# EAGLE board baseboard (EAGLE 9.6.2), part 1 of 2
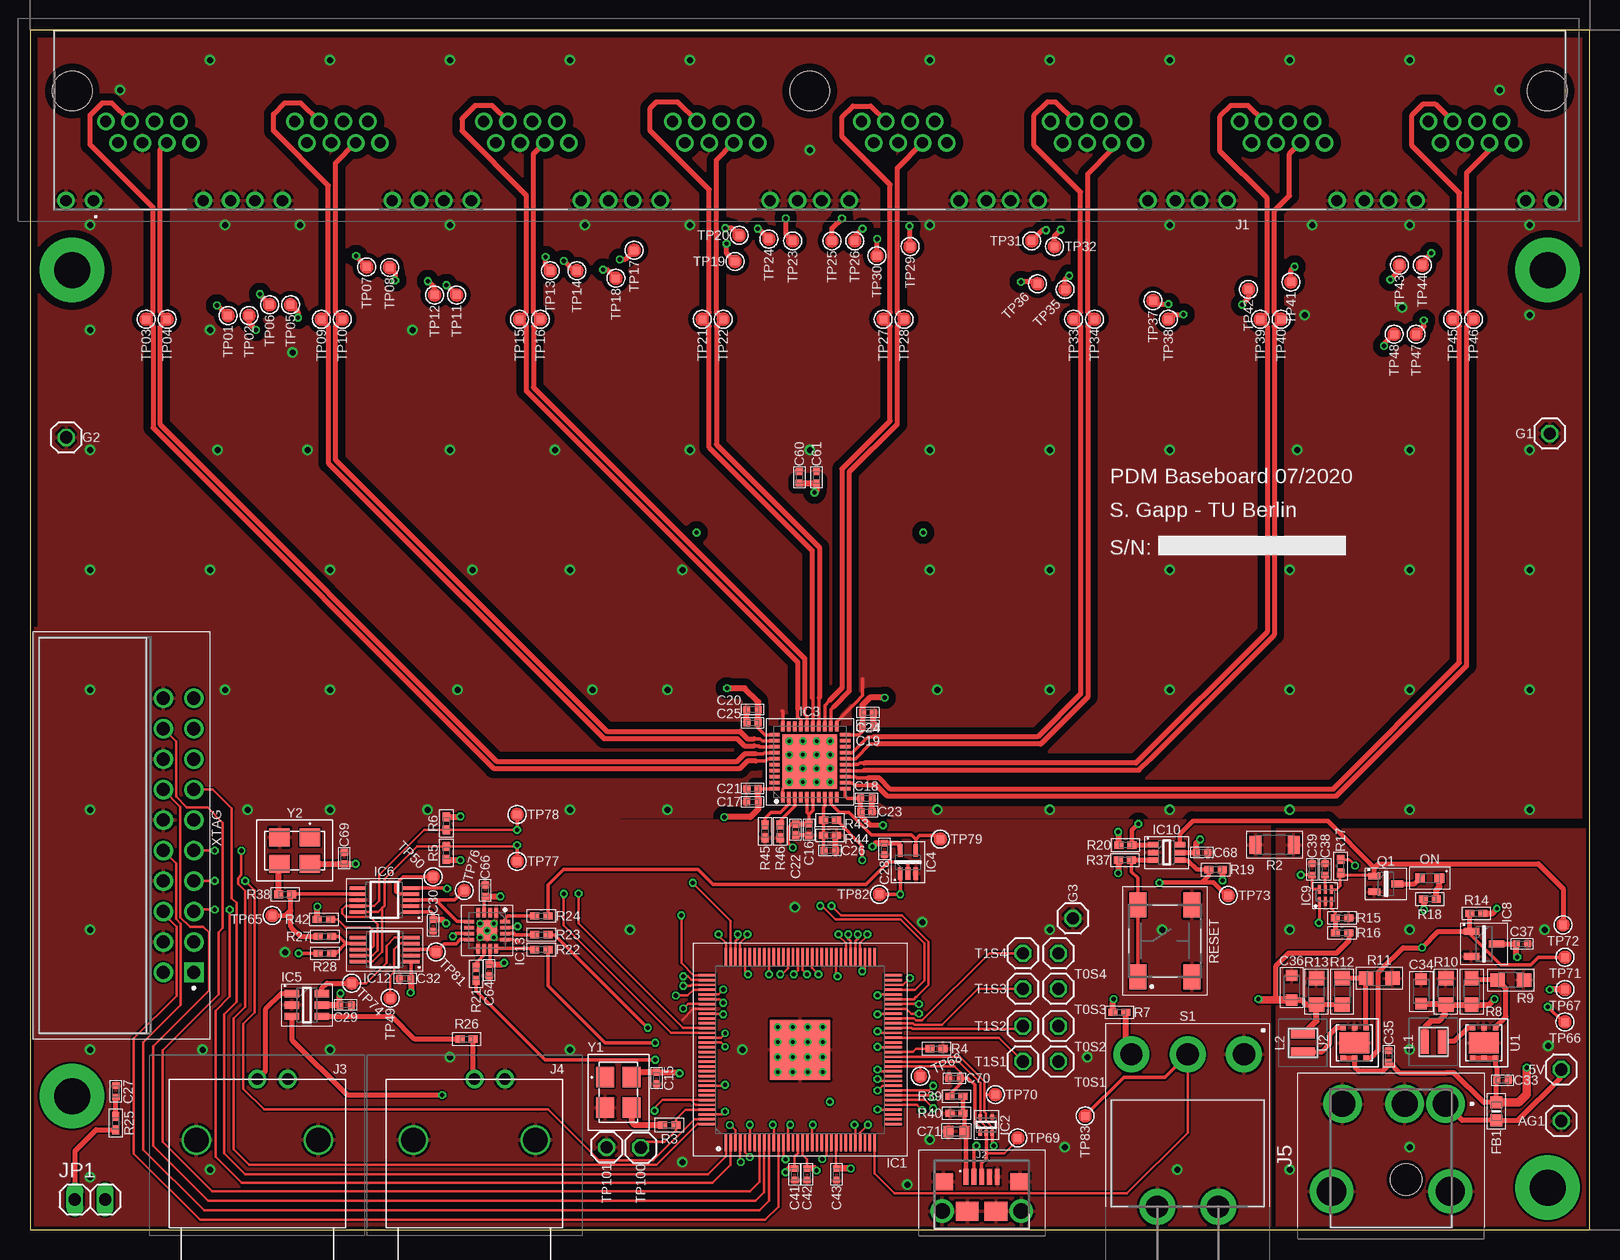
[diagram p5: board, top side]
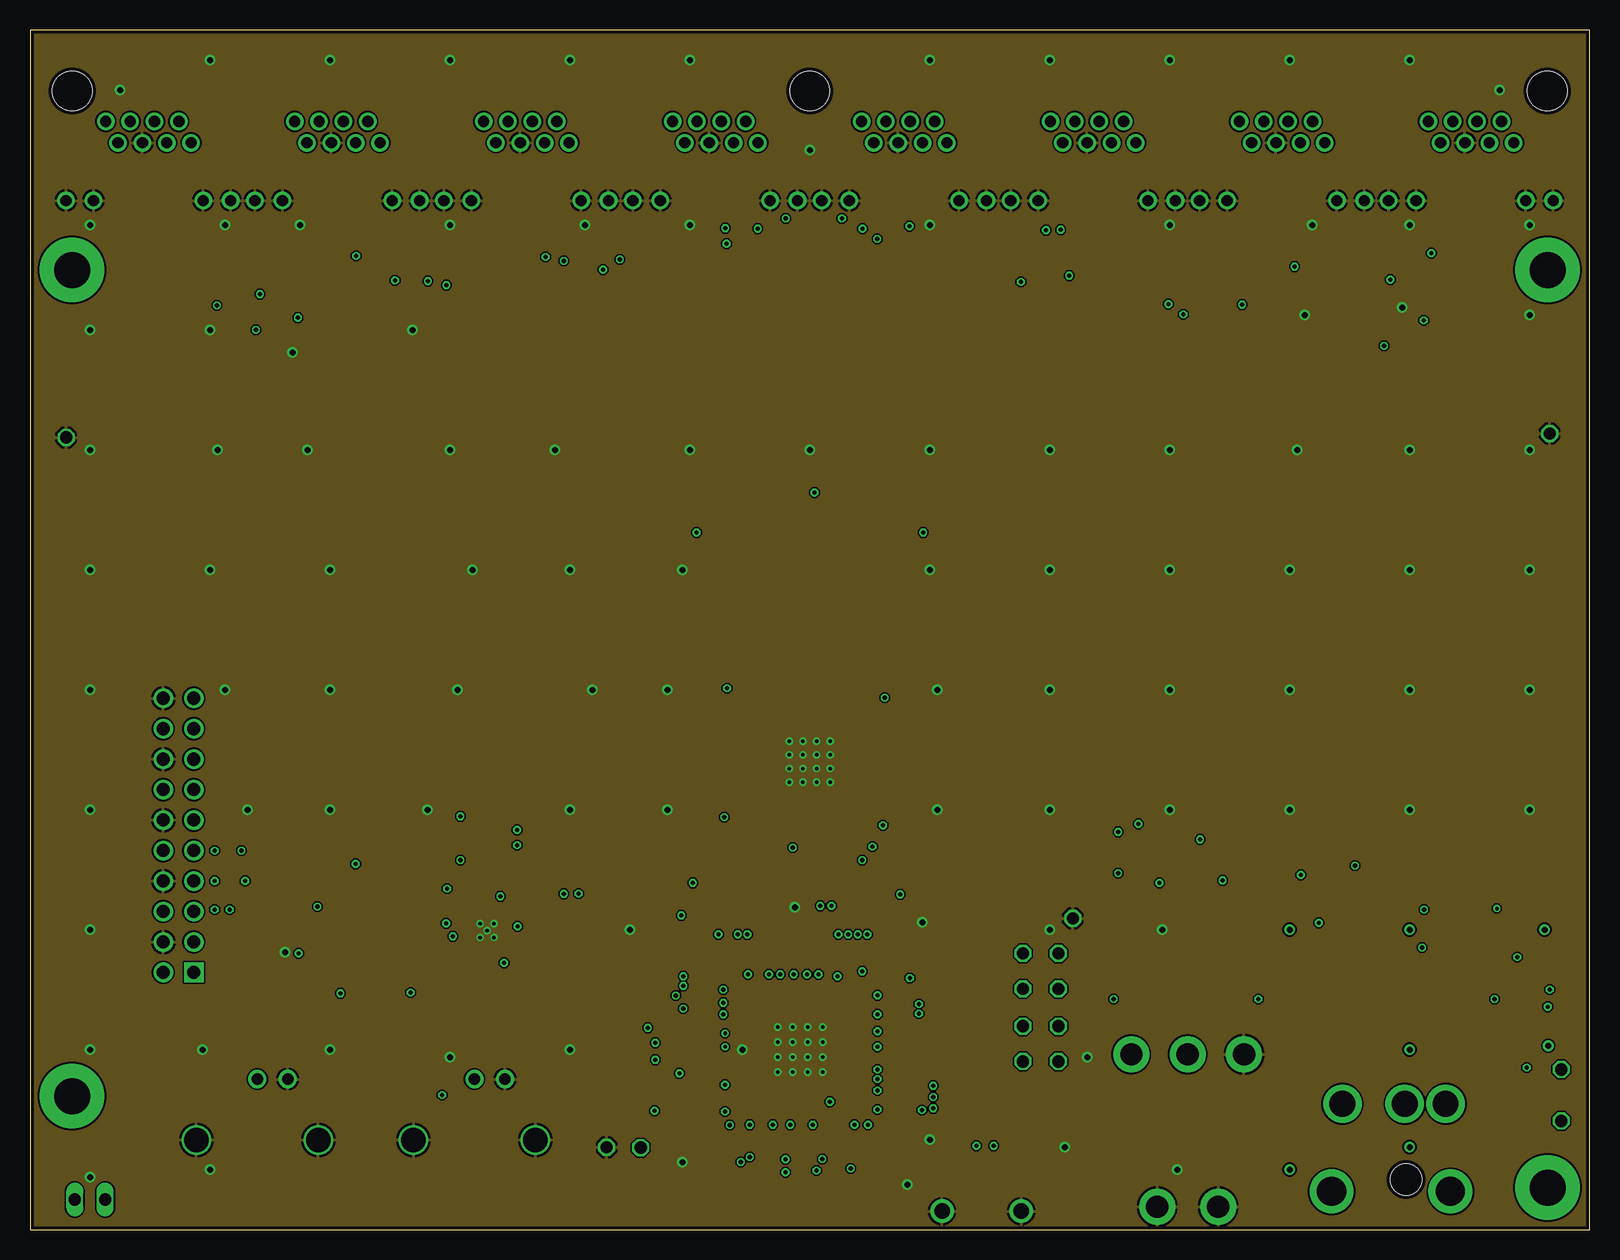
[diagram p6: board, inner layer Route2]
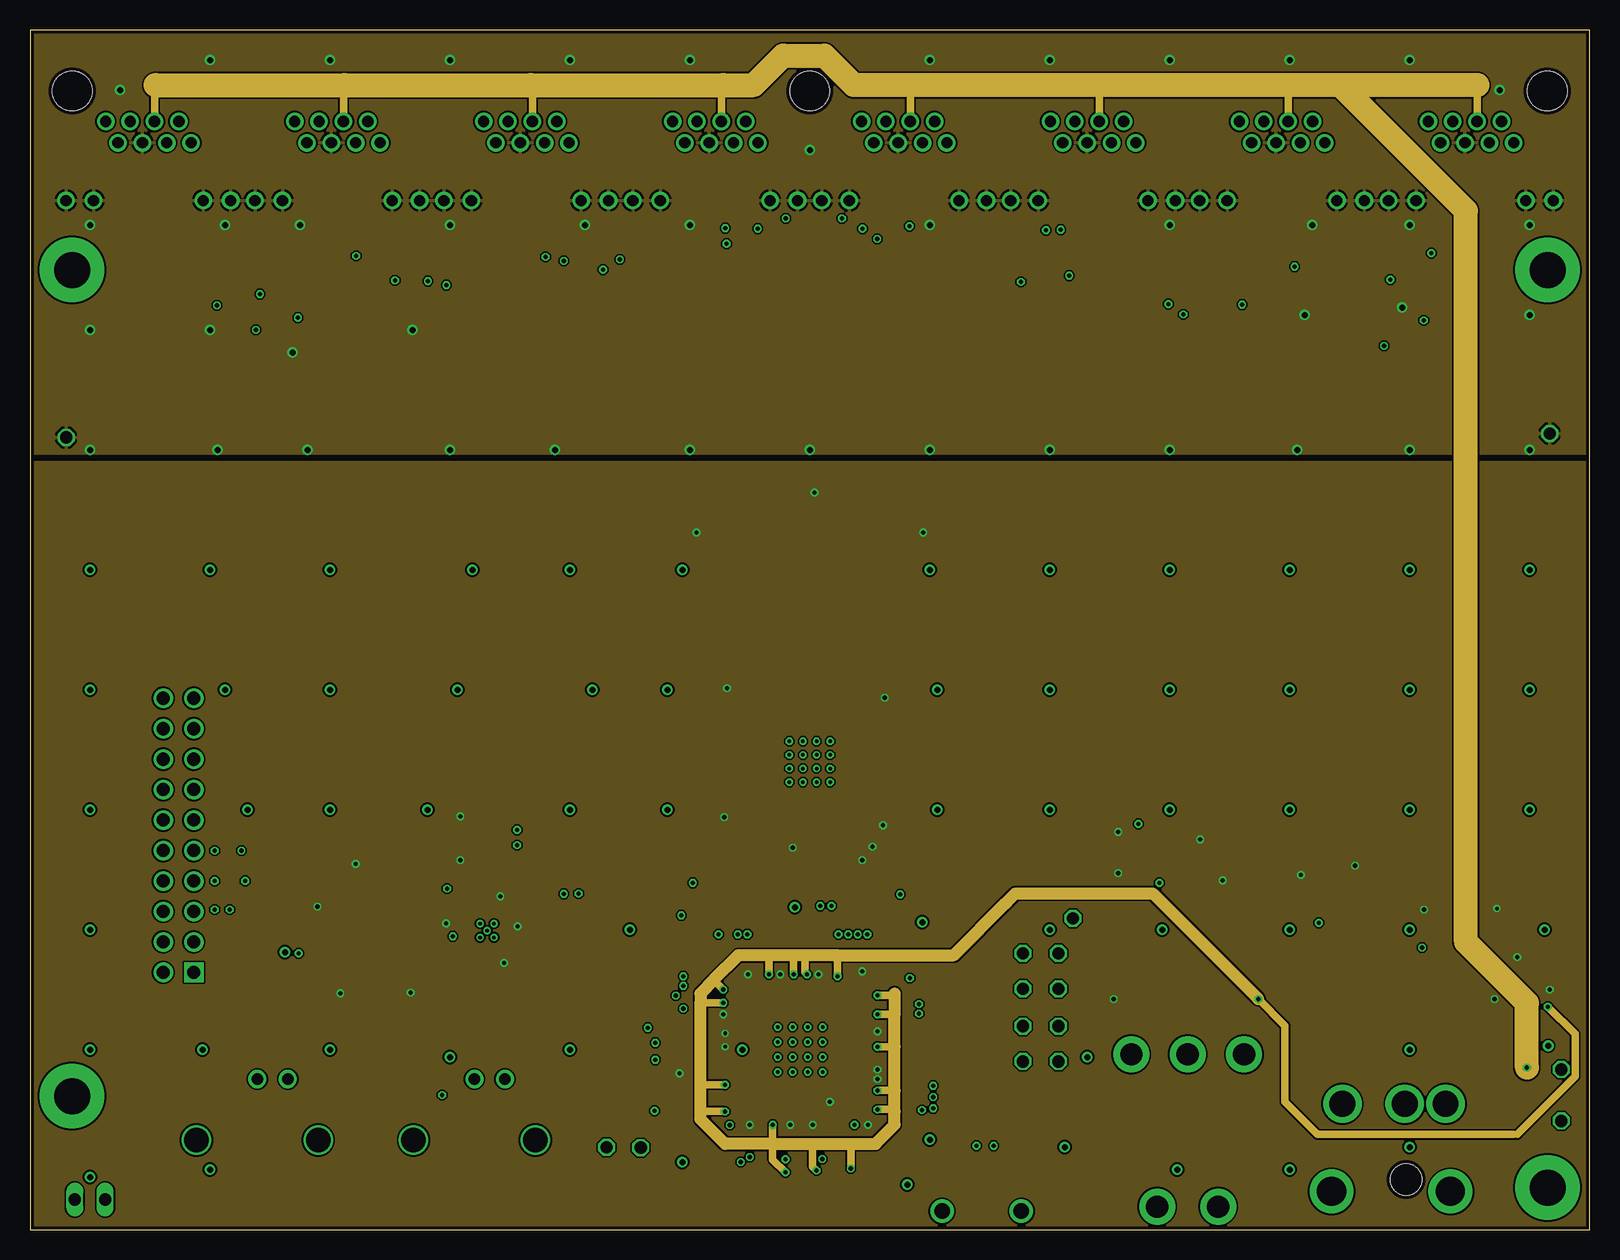
[diagram p7: board, inner layer Route15]
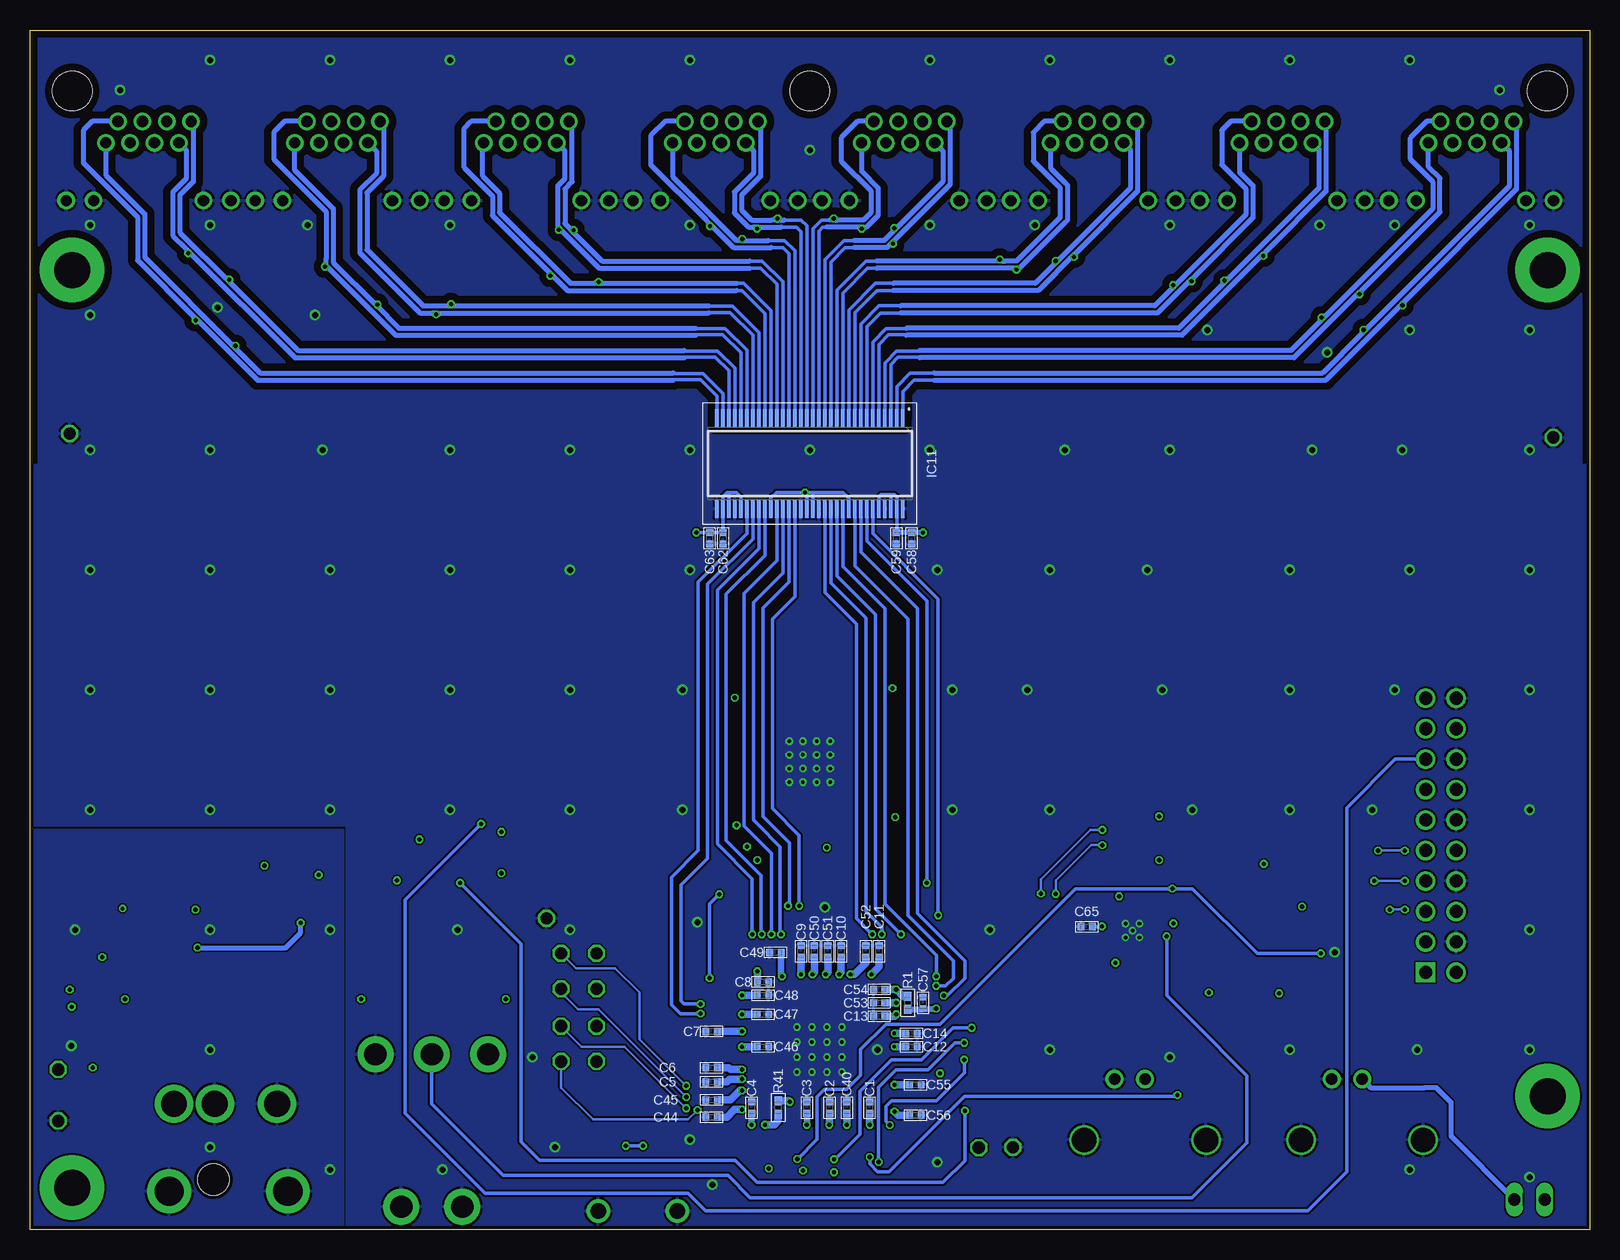
[diagram p8: board, bottom side, seen from below]

Size 130 x 100 mm. Coordinates in mm from the lower left corner, seen from the top.
Outline: 0,0 130,0 130,100 0,100 0,0
Copper layers (1+2*15+16): Top 0.035mm / dielectric 0.38mm / Route2 0.035mm / dielectric 0.71mm / Route15 0.035mm / dielectric 0.38mm / Bottom 0.035mm
Design rules "PCB-POOL Standard_ML4 *": minimum track width 0.15mm, minimum drill 0.3mm, track to track 0.15mm, track to pad 0.15mm, pad to pad 0.15mm, via to via 0.15mm, smd to smd 0.15mm, copper to edge 0.3mm, drill to drill 0.2mm, minimum pad ring 0.2mm, minimum via ring 0.15mm, stop-mask expansion 0.03mm, vias tented up to drill 0mil, thermal gap 0.2mm
Net classes: 1 diff_pair_top: width 0.305 mm, clearance 0.2 mm; 2 diff_pair_bot: width 0.305 mm, clearance 0.2 mm

## Footprints (pad centres in the part's own frame; a part is rotated, then mirrored left to right if it is on the bottom)
1X01 = drill 1.016 octagon: 1 0,0
CAPC1005X55N = smd 0.56 x 0.62: 1 -0.48,0; 2 0.48,0
CAPC1005X55N' = smd 0.6 x 0.62: 1 -0.46,0; 2 0.46,0
CAPC2012X145N = smd 0.95 x 0.95: 1 -1.025,0; 2 1.025,0
CAPC1608X90N = smd 0.81 x 0.94: 1 -0.67,0; 2 0.67,0
BEADC1608X95N = smd 1 x 1: 1 -0.75,0; 2 0.75,0
QFP40P1600X1600X120-129N = smd 1.475 x 0.2: 1 -7.738,6.2; 2 -7.738,5.8; 3 -7.738,5.4; 4 -7.738,5; 5 -7.738,4.6; 6 -7.738,4.2; 7 -7.738,3.8; 8 -7.738,3.4; 9 -7.738,3; 10 -7.738,2.6; 11 -7.738,2.2; 12 -7.738,1.8; 13 -7.738,1.4; 14 -7.738,1; 15 -7.738,0.6; 16 -7.738,0.2; 17 -7.738,-0.2; 18 -7.738,-0.6; 19 -7.738,-1; 20 -7.738,-1.4; 21 -7.738,-1.8; 22 -7.738,-2.2; 23 -7.738,-2.6; 24 -7.738,-3; 25 -7.738,-3.4; 26 -7.738,-3.8; 27 -7.738,-4.2; 28 -7.738,-4.6; 29 -7.738,-5; 30 -7.738,-5.4; 31 -7.738,-5.8; 32 -7.738,-6.2; 65 7.738,-6.2; 66 7.738,-5.8; 67 7.738,-5.4; 68 7.738,-5; 69 7.738,-4.6; 70 7.738,-4.2; 71 7.738,-3.8; 72 7.738,-3.4; 73 7.738,-3; 74 7.738,-2.6; 75 7.738,-2.2; 76 7.738,-1.8; 77 7.738,-1.4; 78 7.738,-1; 79 7.738,-0.6; 80 7.738,-0.2; 81 7.738,0.2; 82 7.738,0.6; 83 7.738,1; 84 7.738,1.4; 85 7.738,1.8; 86 7.738,2.2; 87 7.738,2.6; 88 7.738,3; 89 7.738,3.4; 90 7.738,3.8; 91 7.738,4.2; 92 7.738,4.6; 93 7.738,5; 94 7.738,5.4; 95 7.738,5.8; 96 7.738,6.2 | smd 0.2 x 1.475: 33 -6.2,-7.738; 34 -5.8,-7.738; 35 -5.4,-7.738; 36 -5,-7.738; 37 -4.6,-7.738; 38 -4.2,-7.738; 39 -3.8,-7.738; 40 -3.4,-7.738; 41 -3,-7.738; 42 -2.6,-7.738; 43 -2.2,-7.738; 44 -1.8,-7.738; 45 -1.4,-7.738; 46 -1,-7.738; 47 -0.6,-7.738; 48 -0.2,-7.738; 49 0.2,-7.738; 50 0.6,-7.738; 51 1,-7.738; 52 1.4,-7.738; 53 1.8,-7.738; 54 2.2,-7.738; 55 2.6,-7.738; 56 3,-7.738; 57 3.4,-7.738; 58 3.8,-7.738; 59 4.2,-7.738; 60 4.6,-7.738; 61 5,-7.738; 62 5.4,-7.738; 63 5.8,-7.738; 64 6.2,-7.738; 97 6.2,7.738; 98 5.8,7.738; 99 5.4,7.738; 100 5,7.738; 101 4.6,7.738; 102 4.2,7.738; 103 3.8,7.738; 104 3.4,7.738; 105 3,7.738; 106 2.6,7.738; 107 2.2,7.738; 108 1.8,7.738; 109 1.4,7.738; 110 1,7.738; 111 0.6,7.738; 112 0.2,7.738; 113 -0.2,7.738; 114 -0.6,7.738; 115 -1,7.738; 116 -1.4,7.738; 117 -1.8,7.738; 118 -2.2,7.738; 119 -2.6,7.738; 120 -3,7.738; 121 -3.4,7.738; 122 -3.8,7.738; 123 -4.2,7.738; 124 -4.6,7.738; 125 -5,7.738; 126 -5.4,7.738; 127 -5.8,7.738; 128 -6.2,7.738 | smd 5 x 5: 129 0,0
SOTFL50P160X60-5N = smd 0.45 x 0.3: 1 -0.675,0.5; 2 -0.675,0; 3 -0.675,-0.5; 4 0.675,-0.5; 5 0.675,0.5
QFN50P600X600X80-41N = smd 0.85 x 0.3: 1 -2.95,2.25; 2 -2.95,1.75; 3 -2.95,1.25; 4 -2.95,0.75; 5 -2.95,0.25; 6 -2.95,-0.25; 7 -2.95,-0.75; 8 -2.95,-1.25; 9 -2.95,-1.75; 10 -2.95,-2.25; 21 2.95,-2.25; 22 2.95,-1.75; 23 2.95,-1.25; 24 2.95,-0.75; 25 2.95,-0.25; 26 2.95,0.25; 27 2.95,0.75; 28 2.95,1.25; 29 2.95,1.75; 30 2.95,2.25 | smd 0.3 x 0.85: 11 -2.25,-2.95; 12 -1.75,-2.95; 13 -1.25,-2.95; 14 -0.75,-2.95; 15 -0.25,-2.95; 16 0.25,-2.95; 17 0.75,-2.95; 18 1.25,-2.95; 19 1.75,-2.95; 20 2.25,-2.95; 31 2.25,2.95; 32 1.75,2.95; 33 1.25,2.95; 34 0.75,2.95; 35 0.25,2.95; 36 -0.25,2.95; 37 -0.75,2.95; 38 -1.25,2.95; 39 -1.75,2.95; 40 -2.25,2.95 | smd 4.55 x 4.55: 41 0,0
SOT65P212X110-5N = smd 1.05 x 0.4: 1 -0.95,0.65; 2 -0.95,0; 3 -0.95,-0.65; 4 0.95,-0.65; 5 0.95,0.65
SOT95P280X145-6N = smd 1.2 x 0.6: 1 -1.25,0.95; 2 -1.25,0; 3 -1.25,-0.95; 4 1.25,-0.95; 5 1.25,0; 6 1.25,0.95
SOP50P490X110-10N = smd 1.4 x 0.3: 1 -2.2,1; 2 -2.2,0.5; 3 -2.2,0; 4 -2.2,-0.5; 5 -2.2,-1; 6 2.2,-1; 7 2.2,-0.5; 8 2.2,0; 9 2.2,0.5; 10 2.2,1
SOT103P237X112-3N = smd 1.3 x 0.6: 1 -1.05,1.03; 2 -1.05,-1.03; 3 1.05,0
SON50P100X150X75-6N = smd 0.75 x 0.25: 1 -0.5,0.5; 2 -0.5,0; 3 -0.5,-0.5; 4 0.5,-0.5; 5 0.5,0; 6 0.5,0.5
SOP65P210X110-6N = smd 0.95 x 0.45: 1 -1.1,0.65; 2 -1.1,0; 3 -1.1,-0.65; 4 1.1,-0.65; 5 1.1,0; 6 1.1,0.65
SOP50P810X120-64N = smd 1.475 x 0.3: 1 -3.788,7.75; 2 -3.788,7.25; 3 -3.788,6.75; 4 -3.788,6.25; 5 -3.788,5.75; 6 -3.788,5.25; 7 -3.788,4.75; 8 -3.788,4.25; 9 -3.788,3.75; 10 -3.788,3.25; 11 -3.788,2.75; 12 -3.788,2.25; 13 -3.788,1.75; 14 -3.788,1.25; 15 -3.788,0.75; 16 -3.788,0.25; 17 -3.788,-0.25; 18 -3.788,-0.75; 19 -3.788,-1.25; 20 -3.788,-1.75; 21 -3.788,-2.25; 22 -3.788,-2.75; 23 -3.788,-3.25; 24 -3.788,-3.75; 25 -3.788,-4.25; 26 -3.788,-4.75; 27 -3.788,-5.25; 28 -3.788,-5.75; 29 -3.788,-6.25; 30 -3.788,-6.75; 31 -3.788,-7.25; 32 -3.788,-7.75; 33 3.788,-7.75; 34 3.788,-7.25; 35 3.788,-6.75; 36 3.788,-6.25; 37 3.788,-5.75; 38 3.788,-5.25; 39 3.788,-4.75; 40 3.788,-4.25; 41 3.788,-3.75; 42 3.788,-3.25; 43 3.788,-2.75; 44 3.788,-2.25; 45 3.788,-1.75; 46 3.788,-1.25; 47 3.788,-0.75; 48 3.788,-0.25; 49 3.788,0.25; 50 3.788,0.75; 51 3.788,1.25; 52 3.788,1.75; 53 3.788,2.25; 54 3.788,2.75; 55 3.788,3.25; 56 3.788,3.75; 57 3.788,4.25; 58 3.788,4.75; 59 3.788,5.25; 60 3.788,5.75; 61 3.788,6.25; 62 3.788,6.75; 63 3.788,7.25; 64 3.788,7.75
QFN50P300X300X100-17N = smd 0.8 x 0.3: 1 -1.5,0.75; 2 -1.5,0.25; 3 -1.5,-0.25; 4 -1.5,-0.75; 9 1.5,-0.75; 10 1.5,-0.25; 11 1.5,0.25; 12 1.5,0.75 | smd 0.3 x 0.8: 5 -0.75,-1.5; 6 -0.25,-1.5; 7 0.25,-1.5; 8 0.75,-1.5; 13 0.75,1.5; 14 0.25,1.5; 15 -0.25,1.5; 16 -0.75,1.5 | smd 1.66 x 1.66: 17 0,0
RJHSE508108 = drill 0.94 pad 1.462: A1 58.68,7.62; A2 57.66,9.4; A3 56.65,7.62; A4 55.63,9.4; A5 54.62,7.62; A6 53.6,9.4; A7 52.59,7.62; A8 51.57,9.4; A9 61.99,14.22; A10 59.7,14.22; A11 50.56,14.22; A12 48.27,14.22; B1 42.93,7.62; B2 41.91,9.4; B3 40.9,7.62; B4 39.88,9.4; B5 38.87,7.62; B6 37.85,9.4; B7 36.84,7.62; B8 35.82,9.4; B9 46.24,14.22; B10 43.95,14.22; B11 34.81,14.22; B12 32.52,14.22; C1 27.18,7.62; C2 26.16,9.4; C3 25.15,7.62; C4 24.13,9.4; C5 23.12,7.62; C6 22.1,9.4; C7 21.09,7.62; C8 20.07,9.4; C9 30.49,14.22; C10 28.2,14.22; C11 19.06,14.22; C12 16.77,14.22; D1 11.43,7.62; D2 10.41,9.4; D3 9.4,7.62; D4 8.38,9.4; D5 7.37,7.62; D6 6.35,9.4; D7 5.34,7.62; D8 4.32,9.4; D9 14.74,14.22; D10 12.45,14.22; D11 3.31,14.22; D12 1.02,14.22; E1 -4.32,7.62; E2 -5.34,9.4; E3 -6.35,7.62; E4 -7.37,9.4; E5 -8.38,7.62; E6 -9.4,9.4; E7 -10.41,7.62; E8 -11.43,9.4; E9 -1.01,14.22; E10 -3.3,14.22; E11 -12.44,14.22; E12 -14.73,14.22; F1 -20.07,7.62; F2 -21.09,9.4; F3 -22.1,7.62; F4 -23.12,9.4; F5 -24.13,7.62; F6 -25.15,9.4; F7 -26.16,7.62; F8 -27.18,9.4; F9 -16.76,14.22; F10 -19.05,14.22; F11 -28.19,14.22; F12 -30.48,14.22; G1 -35.82,7.62; G2 -36.84,9.4; G3 -37.85,7.62; G4 -38.87,9.4; G5 -39.88,7.62; G6 -40.9,9.4; G7 -41.91,7.62; G8 -42.93,9.4; G9 -32.51,14.22; G10 -34.8,14.22; G11 -43.94,14.22; G12 -46.23,14.22; H1 -51.57,7.62; H2 -52.59,9.4; H3 -53.6,7.62; H4 -54.62,9.4; H5 -55.63,7.62; H6 -56.65,9.4; H7 -57.66,7.62; H8 -58.68,9.4; H9 -48.26,14.22; H10 -50.55,14.22; H11 -59.69,14.22; H12 -61.98,14.22 | hole 3.3: 61.47,5.08; 0,5.08; -61.47,5.08
101181930001LF = smd 0.4 x 1.35: 1 -1.3,4.325; 2 -0.65,4.325; 3 0,4.325; 4 0.65,4.325; 5 1.3,4.325 | drill 1.3 pad 1.95: MH1 -3.3,1.45; MH2 3.3,1.45 | smd 1.6 x 1.4: MP1 -3.2,3.9; MP4 3.2,3.9 | smd 1.9 x 1.6: MP2 -1.2,1.45; MP3 1.2,1.45
116346220 = drill 0.97 pad 1.509: 1 0,0; 2 -2.54,0 | drill 2.06: MH1 5.08,5.08; MH2 -5.08,5.08
PJ079BH = drill 2.154 pad 3.2: 1 0,0; 2 0,8.6; 3 0,3.4 | drill 2.435 pad 3.653: MH1 -7.3,9.5; MH2 -7.3,-0.4 | hole 2.6: -6.3,3.3
1X02 = drill 1.016 long: 1 -1.27,0; 2 1.27,0
NRH2412T2R2MNGH = smd 0.7 x 2: 1 -0.725,0; 2 0.725,0
LEDC1608X80N = smd 0.8 x 0.8: 1 -0.8,0; 2 0.8,0
SOT65P210X110-3N = smd 1 x 0.55: 1 -0.95,0.65; 2 -0.95,-0.65; 3 0.95,0
RESC1005X40N = smd 0.75 x 0.6: 1 -0.55,0; 2 0.55,0
RESC3116X65N = smd 1 x 1.5: 1 -1.6,0; 2 1.6,0
RESC1005X40N' = smd 0.75 x 0.65: 1 -0.55,0; 2 0.55,0
RESC2012X65N = smd 1.2 x 1.15: 1 -1.1,0; 2 1.1,0
RESC2012X70N = smd 1.2 x 1.15: 1 -1.1,0; 2 1.1,0
RESC2013X65N = smd 1.2 x 1.3: 1 -1.1,0; 2 1.1,0
RESC0402X15N = smd 0.75 x 0.6: 1 -0.55,0; 2 0.55,0
RESC1005X35N = smd 0.75 x 0.6: 1 -0.55,0; 2 0.55,0
LL3301FF065QJ = smd 2.1 x 1.4: 1 -3,2.25; 2 3,2.25; 3 -3,-2.25; 4 3,-2.25
100SP1T2B4M6QE = drill 1.85 pad 3: 1 0,0; 2 4.7,0; 3 9.4,0; MH1 2.16,12.7; MH2 7.24,12.7
TP_05_05 = smd 0.635 x 0.635: TP 0,0
DFN6D = smd 0.45 x 0.5: 1 -0.95,-1.3; 2 0,-1.3; 3 0.95,-1.3; 4 0.95,1.3; 5 0,1.3; 6 -0.95,1.3 | smd 2.5 x 1.75: GND 0,0
303205002HB = drill 1.092 pad 1.638 square: 1 0,0 | drill 1.092 pad 1.638: 2 0,2.54; 3 2.54,0; 4 2.54,2.54; 5 5.08,0; 6 5.08,2.54; 7 7.62,0; 8 7.62,2.54; 9 10.16,0; 10 10.16,2.54; 11 12.7,0; 12 12.7,2.54; 13 15.24,0; 14 15.24,2.54; 15 17.78,0; 16 17.78,2.54; 17 20.32,0; 18 20.32,2.54; 19 22.86,0; 20 22.86,2.54
ASFL-1 = smd 1.7 x 1.5: GND 1.27,-1.1; OUT 1.27,1.1; TRI -1.27,-1.1; VDD -1.27,1.1

## Placement (x,y rotation side)
5V  [1X01]  127.64,13.34 0 top
AG1  [1X01]  127.64,9.05 0 top
C1  100nF  [CAPC1005X55N]  60.01,10.16 270 bottom
C2  100nF  [CAPC1005X55N]  63.34,10.16 270 bottom
C3  100nF  [CAPC1005X55N]  65.25,10.16 270 bottom
C4  100nF  [CAPC1005X55N]  69.85,10.16 270 bottom
C5  100nF  [CAPC1005X55N]  73.18,12.3 0 bottom
C6  100nF  [CAPC1005X55N]  73.18,13.49 0 bottom
C7  100nF  [CAPC1005X55N]  73.18,16.51 0 bottom
C8  100nF  [CAPC1005X55N]  68.9,20.64 180 bottom
C9  100nF  [CAPC1005X55N]  65.72,23.18 270 bottom
C10  100nF  [CAPC1005X55N]  62.39,23.18 270 bottom
C11  100nF  [CAPC1005X55N]  59.21,23.18 270 bottom
C12  100nF  [CAPC1005X55N]  56.52,15.24 180 bottom
C13  100nF  [CAPC1005X55N]  59.21,17.78 0 bottom
C14  100nF  [CAPC1005X55N]  56.52,16.35 180 bottom
C15  100nF  [CAPC1005X55N]  52.23,12.62 90 top
C16  100nF  [CAPC1005X55N]  64.93,33.34 90 top
C17  100nF  [CAPC1005X55N]  60.22,35.65 0 top
C18  100nF  [CAPC1005X55N]  69.72,35.94 180 top
C19  100nF  [CAPC1005X55N]  69.85,42.01 180 top
C20  100nF  [CAPC1005X55N]  60.22,43.34 0 top
C21  1uF  [CAPC1005X55N']  60.22,36.77 0 top
C22  1uF  [CAPC1005X55N']  63.82,33.34 90 top
C23  1uF  [CAPC1005X55N']  69.72,34.83 180 top
C24  1uF  [CAPC1005X55N']  69.85,43.09 180 top
C25  1uF  [CAPC1005X55N']  60.22,42.23 0 top
C26  100nF  [CAPC1005X55N]  66.67,31.59 180 top
C27  130pF  [CAPC1005X55N]  7.16,11.51 90 top
C28  100nF  [CAPC1005X55N]  71.23,31.72 90 top
C29  100nF  [CAPC1005X55N]  26.31,18.71 180 top
C30  100nF  [CAPC1005X55N]  33.6,25.36 90 top
C32  100nF  [CAPC1005X55N]  31.27,20.93 0 top
C33  4u7  [CAPC1005X55N]  122.75,12.45 0 top
C34  22u  [CAPC2012X145N]  115.97,19.84 270 top
C35  4u7  [CAPC1005X55N]  113.27,14.45 90 top
C36  22u  [CAPC2012X145N]  105.17,20.16 270 top
C37  100nF  [CAPC1005X55N]  124.38,23.81 180 top
C38  2N2  [CAPC1005X55N]  107.97,30.03 90 top
C39  100nF  [CAPC1005X55N]  106.88,30.03 270 top
C40  100nF  [CAPC1005X55N]  61.91,10.16 270 bottom
C41  100nF  [CAPC1005X55N]  63.74,4.6 90 top
C42  100nF  [CAPC1005X55N]  64.77,4.6 90 top
C43  100nF  [CAPC1005X55N]  67.23,4.6 90 top
C44  100nF  [CAPC1005X55N]  73.18,9.37 0 bottom
C45  100nF  [CAPC1005X55N]  73.18,10.79 0 bottom
C46  100nF  [CAPC1005X55N]  68.9,15.24 180 bottom
C47  100nF  [CAPC1005X55N]  68.9,17.94 180 bottom
C48  100nF  [CAPC1005X55N]  68.9,19.53 180 bottom
C49  100nF  [CAPC1005X55N]  67.87,23.1 0 bottom
C50  100nF  [CAPC1005X55N]  64.61,23.18 270 bottom
C51  100nF  [CAPC1005X55N]  63.5,23.18 270 bottom
C52  100nF  [CAPC1005X55N]  60.33,23.18 270 bottom
C53  100nF  [CAPC1005X55N]  59.21,18.89 0 bottom
C54  100nF  [CAPC1005X55N]  59.21,20.01 0 bottom
C55  100nF  [CAPC1005X55N]  56.2,12.06 180 bottom
C56  100nF  [CAPC1005X55N]  56.2,9.53 180 bottom
C57  100nF  [CAPC1005X55N]  55.56,18.89 270 bottom
C58  100nF  [CAPC1005X55N]  56.52,57.63 90 bottom
C59  100nF  [CAPC1005X55N]  57.78,57.63 90 bottom
C60  100nF  [CAPC1005X55N]  64.14,62.71 270 top
C61  100nF  [CAPC1005X55N]  65.56,62.71 270 top
C62  100nF  [CAPC1005X55N]  72.23,57.63 90 bottom
C63  100nF  [CAPC1005X55N]  73.34,57.63 90 bottom
C64  100nF  [CAPC1005X55N]  38.27,21.62 90 top
C65  100nF  [CAPC1005X55N]  41.91,25.24 0 bottom
C66  100nF  [CAPC1005X55N]  37.94,28.26 270 top
C68  100nF  [CAPC1005X55N]  97.7,31.43 180 top
C69  100nF  [CAPC1005X55N]  26.19,30.96 270 top
C70  100nF  [CAPC1005X55N]  77.07,12.62 0 top
C71  GRM188R71A225KE15D  [CAPC1608X90N]  77.23,8.18 180 top
FB1  BLM18PG121SN1D  [BEADC1608X95N]  122.24,9.84 90 top
G1  [1X01]  126.68,66.36 0 top
G2  [1X01]  3.02,66.04 0 top
G3  [1X01]  86.93,25.94 0 top
IC1  XUF216-512-TQ128-C20  [QFP40P1600X1600X120-129N]  64.2,15 90 top
IC2  TPD2E001DRLRG4  [SOTFL50P160X60-5N]  79.71,8.72 90 top
IC3  PI6C5921512ZDIEX  [QFN50P600X600X80-41N]  65,39 90 top
IC4  74AHC1G79GW,125  [SOT65P212X110-5N]  73.18,30.62 90 top
IC5  SN74LVC2G34DBVR  [SOT95P280X145-6N]  23.08,18.71 0 top
IC6  CS2100CP-CZZ  [SOP50P490X110-10N]  29.53,27.46 180 top
IC8  STM1061N28WX6F  [SOT103P237X112-3N]  121.2,23.81 0 top
IC9  MAX6895AALT+T  [SON50P100X150X75-6N]  107.97,27.85 90 top
IC10  74LVC1G11GW,125  [SOP65P210X110-6N]  94.75,31.43 0 top
IC11  SN65LVDT386DGG  [SOP50P810X120-64N]  65,63.85 270 bottom
IC12  CS2100CP-CZZ  [SOP50P490X110-10N]  29.56,23.34 180 top
IC13  LMK00804BQWRGTTQ1  [QFN50P300X300X100-17N]  38.1,24.92 270 top
J1  RJHSE-5081-08  [RJHSE508108]  65,100 180 top
J2  10118193-0001LF  [101181930001LF]  79.33,0.08 0 top
J3  1-1634622-0  [116346220]  18.95,12.54 180 top
J4  1-1634622-0  [116346220]  37.05,12.54 180 top
J5  PJ-079BH  [PJ079BH]  118,10.48 90 top
JP1  [1X02]  5,2.5 0 top
L1  NRH2412T2R2MNGH  [NRH2412T2R2MNGH]  117,15.64 0 top
L2  NRH2412T2R2MNGH  [NRH2412T2R2MNGH]  106.12,15.56 270 top
ON  150060VS75000  [LEDC1608X80N]  116.68,29.29 0 top
Q1  BSS138PW,115  [SOT65P210X110-3N]  113.03,28.81 0 top
R1  4R7  [RESC1005X40N]  56.83,18.89 270 bottom
R2  0R  [RESC3116X65N]  103.74,32.08 180 top
R3  33R  [RESC1005X40N']  53.3,8.71 0 top
R4  43R2  [RESC1005X40N]  75.56,15.08 180 top
R5  1K  [RESC1005X40N]  34.72,31.39 270 top
R6  1K  [RESC1005X40N]  34.71,33.86 90 top
R7  1K  [RESC1005X40N]  90.81,18.1 180 top
R8  18K  [RESC2012X65N]  120.17,19.84 270 top
R9  5K6  [RESC2012X70N]  123.43,20.8 0 top
R10  2K2  [RESC2013X65N]  118.03,19.84 270 top
R11  18K  [RESC2012X65N]  112.47,20.95 180 top
R12  4K7  [RESC2013X65N]  109.38,19.84 270 top
R13  AS08J1001ET  [RESC2013X65N]  107.23,19.84 270 top
R14  10k  [RESC1005X40N]  120.57,26.35 0 top
R15  10k  [RESC1005X40N]  109.37,25.98 180 top
R16  3K9  [RESC0402X15N]  109.37,24.74 0 top
R17  10k  [RESC1005X40N]  109.25,30.29 90 top
R18  150R  [RESC1005X40N]  116.68,27.54 180 top
R19  10k  [RESC1005X40N]  98.83,30.01 0 top
R20  10k  [RESC1005X40N]  91.32,32.05 180 top
R21  43R  [RESC1005X40N]  37.18,21.31 90 top
R22  43R  [RESC1005X40N]  42.63,23.34 180 top
R23  43R  [RESC1005X40N]  42.63,24.58 180 top
R24  43R  [RESC1005X40N]  42.63,26.14 180 top
R25  75R  [RESC1005X40N]  7.16,8.87 90 top
R26  75R  [RESC1005X40N]  36.4,15.87 0 top
R27  CRCW04020000Z0EDC  [RESC1005X35N]  24.58,24.43 0 top
R28  CRCW04020000Z0EDC  [RESC1005X35N]  24.58,23.03 0 top
R37  10k  [RESC1005X40N]  91.28,30.8 180 top
R38  33R  [RESC1005X40N']  21.27,27.94 0 top
R39  10k  [RESC1005X40N]  77.23,11.11 0 top
R40  CRCW040247K0FKEDC  [RESC1005X35N]  77.23,9.68 180 top
R41  1K  [RESC1005X40N]  67.63,10.16 90 bottom
R42  1K  [RESC1005X40N]  24.51,25.86 180 top
R43  1K  [RESC1005X40N]  66.67,34.13 0 top
R44  1K  [RESC1005X40N]  66.67,32.86 180 top
R45  1K  [RESC1005X40N]  61.28,33.18 90 top
R46  1K  [RESC1005X40N]  62.55,33.18 90 top
RESET  LL3301AF065QJ  [LL3301FF065QJ]  94.61,24.05 90 top
S1  100SP1T2B4M6QE  [100SP1T2B4M6QE]  101.2,14.61 180 top
T0S1  [1X01]  85.72,14 0 top
T0S2  [1X01]  85.72,16.96 0 top
T0S3  [1X01]  85.72,20.07 0 top
T0S4  [1X01]  85.72,23.03 0 top
T1S1  [1X01]  82.77,14 0 top
T1S2  [1X01]  82.77,16.96 0 top
T1S3  [1X01]  82.77,20.07 0 top
T1S4  [1X01]  82.77,23.03 0 top
TP01  TESTPOINT_05_05  [TP_05_05]  16.51,76.19 0 top
TP02  TESTPOINT_05_05  [TP_05_05]  18.26,76.19 0 top
TP03  TESTPOINT_05_05  [TP_05_05]  9.68,75.88 0 top
TP04  TESTPOINT_05_05  [TP_05_05]  11.43,75.88 0 top
TP05  TESTPOINT_05_05  [TP_05_05]  21.72,77.09 0 top
TP06  TESTPOINT_05_05  [TP_05_05]  19.98,77.09 0 top
TP07  TESTPOINT_05_05  [TP_05_05]  28.06,80.25 0 top
TP08  TESTPOINT_05_05  [TP_05_05]  29.98,80.2 0 top
TP09  TESTPOINT_05_05  [TP_05_05]  24.29,75.88 0 top
TP10  TESTPOINT_05_05  [TP_05_05]  26.04,75.88 0 top
TP11  TESTPOINT_05_05  [TP_05_05]  35.56,77.9 0 top
TP12  TESTPOINT_05_05  [TP_05_05]  33.73,77.9 0 top
TP13  TESTPOINT_05_05  [TP_05_05]  43.37,79.93 0 top
TP14  TESTPOINT_05_05  [TP_05_05]  45.59,79.93 0 top
TP15  TESTPOINT_05_05  [TP_05_05]  40.8,75.88 0 top
TP16  TESTPOINT_05_05  [TP_05_05]  42.55,75.88 0 top
TP17  TESTPOINT_05_05  [TP_05_05]  50.36,81.64 0 top
TP18  TESTPOINT_05_05  [TP_05_05]  48.84,79.31 0 top
TP19  TESTPOINT_05_05  [TP_05_05]  58.77,80.71 0 top
TP20  TESTPOINT_05_05  [TP_05_05]  59.12,82.88 0 top
TP21  TESTPOINT_05_05  [TP_05_05]  56.04,75.88 0 top
TP22  TESTPOINT_05_05  [TP_05_05]  57.78,75.88 0 top
TP23  TESTPOINT_05_05  [TP_05_05]  63.58,82.42 0 top
TP24  TESTPOINT_05_05  [TP_05_05]  61.59,82.57 0 top
TP25  TESTPOINT_05_05  [TP_05_05]  66.85,82.42 0 top
TP26  TESTPOINT_05_05  [TP_05_05]  68.75,82.42 0 top
TP27  TESTPOINT_05_05  [TP_05_05]  71.12,75.88 0 top
TP28  TESTPOINT_05_05  [TP_05_05]  72.87,75.88 0 top
TP29  TESTPOINT_05_05  [TP_05_05]  73.37,81.95 0 top
TP30  TESTPOINT_05_05  [TP_05_05]  70.6,81.17 0 top
TP31  TESTPOINT_05_05  [TP_05_05]  83.5,82.42 0 top
TP32  TESTPOINT_05_05  [TP_05_05]  85.4,81.95 0 top
TP33  TESTPOINT_05_05  [TP_05_05]  87,75.88 0 top
TP34  TESTPOINT_05_05  [TP_05_05]  88.74,75.88 0 top
TP35  TESTPOINT_05_05  [TP_05_05]  86.29,78.37 0 top
TP36  TESTPOINT_05_05  [TP_05_05]  83.99,78.84 0 top
TP37  TESTPOINT_05_05  [TP_05_05]  93.61,77.44 0 top
TP38  TESTPOINT_05_05  [TP_05_05]  94.89,75.88 0 top
TP39  TESTPOINT_05_05  [TP_05_05]  102.55,75.88 0 top
TP40  TESTPOINT_05_05  [TP_05_05]  104.3,75.88 0 top
TP41  TESTPOINT_05_05  [TP_05_05]  105.11,78.99 0 top
TP42  TESTPOINT_05_05  [TP_05_05]  101.57,78.37 0 top
TP43  TESTPOINT_05_05  [TP_05_05]  114.16,80.39 0 top
TP44  TESTPOINT_05_05  [TP_05_05]  116.06,80.39 0 top
TP45  TESTPOINT_05_05  [TP_05_05]  118.59,75.88 0 top
TP46  TESTPOINT_05_05  [TP_05_05]  120.33,75.88 0 top
TP47  TESTPOINT_05_05  [TP_05_05]  115.54,74.64 0 top
TP48  TESTPOINT_05_05  [TP_05_05]  113.71,74.64 0 top
TP49  TESTPOINT_05_05  [TP_05_05]  30.03,19.29 0 top
TP50  TESTPOINT_05_05  [TP_05_05]  33.6,29.4 0 top
TP65  TESTPOINT_05_05  [TP_05_05]  20.19,26.17 90 top
TP66  TESTPOINT_05_05  [TP_05_05]  127.95,17.3 0 top
TP67  TESTPOINT_05_05  [TP_05_05]  127.95,20 0 top
TP68  TESTPOINT_05_05  [TP_05_05]  74.22,12.78 270 top
TP69  TESTPOINT_05_05  [TP_05_05]  82.34,7.63 270 top
TP70  TESTPOINT_05_05  [TP_05_05]  80.47,11.25 270 top
TP71  TESTPOINT_05_05  [TP_05_05]  127.95,22.7 0 top
TP72  TESTPOINT_05_05  [TP_05_05]  127.79,25.4 0 top
TP73  TESTPOINT_05_05  [TP_05_05]  99.88,27.85 180 top
TP74  TESTPOINT_05_05  [TP_05_05]  26.82,20.54 0 top
TP76  TESTPOINT_05_05  [TP_05_05]  36.2,28.26 90 top
TP77  TESTPOINT_05_05  [TP_05_05]  40.61,30.7 0 top
TP78  TESTPOINT_05_05  [TP_05_05]  40.61,34.59 0 top
TP79  TESTPOINT_05_05  [TP_05_05]  75.88,32.54 0 top
TP81  TESTPOINT_05_05  [TP_05_05]  33.85,23.14 180 top
TP82  TESTPOINT_05_05  [TP_05_05]  70.8,27.94 180 top
TP83  TESTPOINT_05_05  [TP_05_05]  87.96,9.47 0 top
TP100  [1X01]  50.91,6.83 90 top
TP101  [1X01]  48.07,6.85 270 top
U1  ST1S06APUR  [DFN6D]  121.2,15.56 180 top
U2  ST1S06APUR  [DFN6D]  110.41,15.56 180 top
XTAG  30320-5002HB  [303205002HB]  13.65,21.43 90 top
Y1  ASFL1-24.000MHZ-L-T  [ASFL-1]  49.05,11.43 270 top
Y2  ASFL1-24.576MHZ-EC-T  [ASFL-1]  22.07,31.59 180 top